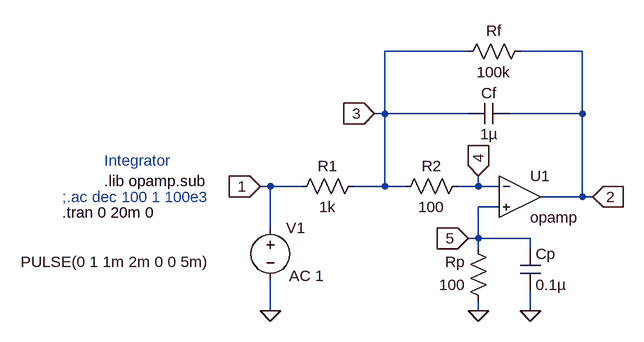
[diagram p0: schematic integrator.asc]
integrator.asc, the LTspice schematic file:
Version 4
SHEET 1 880 680
WIRE 288 -128 160 -128
WIRE 464 -128 368 -128
WIRE 160 -32 160 -128
WIRE 160 -32 144 -32
WIRE 288 -32 160 -32
WIRE 464 -32 464 -128
WIRE 464 -32 352 -32
WIRE -16 80 -32 80
WIRE 32 80 -16 80
WIRE 160 80 160 -32
WIRE 160 80 112 80
WIRE 192 80 160 80
WIRE 304 80 304 64
WIRE 304 80 272 80
WIRE 336 80 304 80
WIRE 464 96 464 -32
WIRE 464 96 400 96
WIRE 480 96 464 96
WIRE 336 112 304 112
WIRE -16 144 -16 80
WIRE 304 160 304 112
WIRE 304 160 288 160
WIRE 384 160 304 160
WIRE 304 176 304 160
WIRE 384 176 384 160
WIRE -16 272 -16 224
WIRE 304 272 304 256
WIRE 384 272 384 240
FLAG 304 272 0
FLAG -16 272 0
FLAG -32 80 1
IOPIN -32 80 In
FLAG 480 96 2
IOPIN 480 96 In
FLAG 288 160 5
IOPIN 288 160 In
FLAG 144 -32 3
IOPIN 144 -32 In
FLAG 304 64 4
IOPIN 304 64 In
FLAG 384 272 0
SYMBOL voltage -16 128 R0
WINDOW 123 29 90 Left 2
WINDOW 39 0 0 Left 0
WINDOW 3 -384 68 Left 2
SYMATTR Value2 AC 1
SYMATTR Value PULSE(0 1 1m 2m 0 0 5m)
SYMATTR InstName V1
SYMBOL OpAmps\\opamp 368 32 R0
SYMATTR InstName U1
SYMBOL res 128 64 R90
WINDOW 0 0 56 VBottom 2
WINDOW 3 32 56 VTop 2
SYMATTR InstName R1
SYMATTR Value 1k
SYMBOL res 288 64 R90
WINDOW 0 0 56 VBottom 2
WINDOW 3 32 56 VTop 2
SYMATTR InstName R2
SYMATTR Value 100
SYMBOL res 320 272 R180
WINDOW 0 36 76 Left 2
WINDOW 3 36 40 Left 2
SYMATTR InstName Rp
SYMATTR Value 100
SYMBOL res 272 -112 R270
WINDOW 0 32 56 VTop 2
WINDOW 3 0 56 VBottom 2
SYMATTR InstName Rf
SYMATTR Value 100k
SYMBOL cap 352 -48 R90
WINDOW 0 0 32 VBottom 2
WINDOW 3 32 32 VTop 2
SYMATTR InstName Cf
SYMATTR Value 1µ
SYMBOL cap 368 176 R0
SYMATTR InstName Cp
SYMATTR Value 0.1µ
TEXT -272 72 Left 2 !.lib opamp.sub
TEXT -336 96 Left 2 ;;.ac dec 100 1 100e3
TEXT -272 40 Left 2 ;Integrator
TEXT -336 120 Left 2 !.tran 0 20m 0

The netlist it stands for:
* integrator.asc
V1 1 0 PULSE(0 1 1m 2m 0 0 5m) AC 1
XU1 4 5 2 opamp Aol=100K GBW=10Meg  ; pins invin noninvin out
R1 3 1 1k
R2 4 3 100
Rp 0 5 100
Rf 3 2 100k
Cf 2 3 1µ
Cp 5 0 0.1µ
.lib opamp.sub
* ;.ac dec 100 1 100e3
* Integrator
.tran 0 20m 0
.backanno
.end